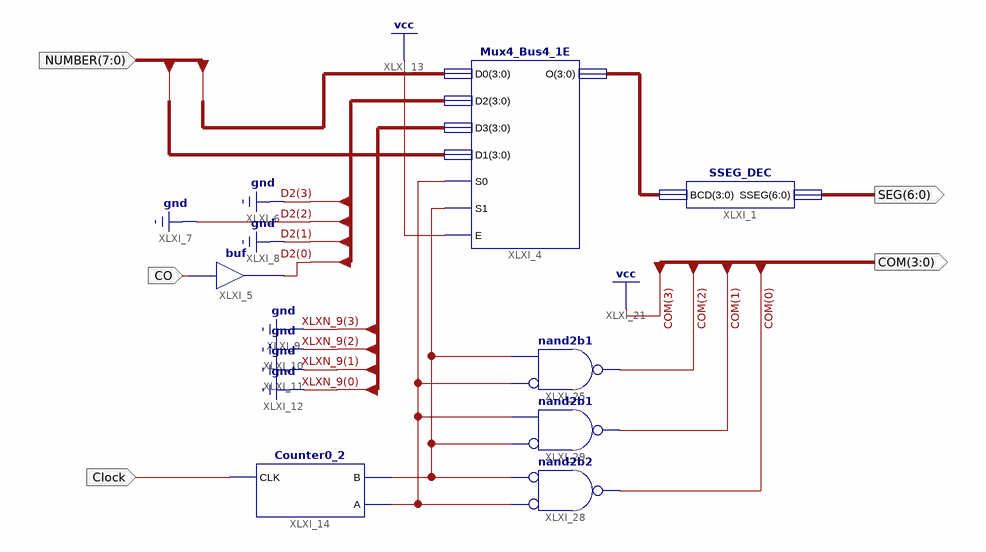
[diagram p0: schematic sheet 1]
// Xilinx ISE schematic Displayer.sch (spartan6) as structural Verilog: 7 symbols, 5 ports
module Displayer (
  input  [7:0] NUMBER,
  input  CO,
  input  Clock,
  output [6:0] SEG,
  output [3:0] COM
);

  wire XLXN_16, XLXN_17;
  wire [0:0] D2;
  wire [3:0] XLXN_1;

  SSEG_DEC XLXI_1 (.BCD(XLXN_1), .SSEG(SEG));
  Mux4_Bus4_1E XLXI_4 (
    .D0(NUMBER[3:0]), .D2({3'b000, D2[0]}), .D3(4'b0000), .D1(NUMBER[7:4]), .S0(XLXN_16), .S1(XLXN_17),
    .E(1'b1), .O(XLXN_1));
  buf XLXI_5 (D2[0], CO);
  Counter0_2 XLXI_14 (.CLK(Clock), .B(XLXN_17), .A(XLXN_16));
  nand XLXI_25 (COM[2], ~XLXN_16, XLXN_17);  // nand2b1
  nand XLXI_28 (COM[0], ~XLXN_16, ~XLXN_17);  // nand2b2
  nand XLXI_29 (COM[1], ~XLXN_17, XLXN_16);  // nand2b1

  assign COM[3] = 1'b1;
endmodule
